# EAGLE design finger-1 (EAGLE 7.2.0)
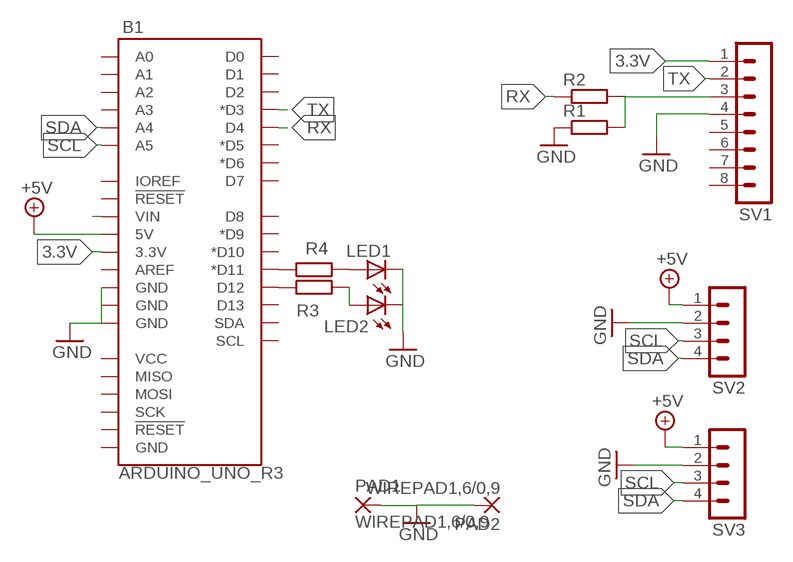
[diagram p0: schematic, sheet 1]

## Parts
B1  ARDUINO_UNO_R3  [ARDUINO_R3]
LED1  LED3MM  [LED3MM]
LED2  LED3MM  [LED3MM]
PAD1  WIREPAD1,6/0,9  [1,6/0,9]
PAD2  WIREPAD1,6/0,9  [1,6/0,9]
R1  R-EU_0207/7  [0207/7]
R2  R-EU_0207/7  [0207/7]
R3  R-EU_0207/7  [0207/7]
R4  R-EU_0207/7  [0207/7]
SV1  MA08-1  [MA08-1]
SV2  MA04-1  [MA04-1]
SV3  MA04-1  [MA04-1]

## Nets
3.3V: B1.3.3V SV1.1
+5V: B1.5V SV2.1 SV3.1
GND: B1.GND@2(GND) B1.GND@3(GND) B1.GND@4(GND) LED1.K(C) LED2.K(C) PAD1.1(P) PAD2.1(P) R1.1 SV1.4 SV2.2 SV3.2
N$1: B1.D12 R3.1
N$2: B1.D11(*D11) R4.1
N$3: LED2.A R3.2
N$4: LED1.A R4.2
N$5: R1.2 R2.2 SV1.3
N$9: B1.VIN
RX: B1.D4 R2.1
SCL: B1.A5 SV2.3 SV3.3
SDA: B1.A4 SV2.4 SV3.4
TX: B1.D3(*D3) SV1.2
Unconnected: B1.A0 B1.A1 B1.A2 B1.A3 B1.AREF B1.D0 B1.D1 B1.D2 B1.D5(*D5) B1.D6(*D6) B1.D7 B1.D8 B1.D9(*D9) B1.D10(*D10) B1.D13 B1.GND@1(GND) B1.IOREF B1.MISO B1.MOSI B1.RESET@1(!RESET!) B1.RESET@2(!RESET!) B1.SCK B1.SCL B1.SDA B1.VCC SV1.5 SV1.6 SV1.7 SV1.8

## Library data of the parts
B1 = treser_lib:ARDUINO_UNO_R3: Arduino Uno R3 Arduino Uno R3 Compatible Footprint with SPI header. Matches PCB size of the original board.
LED1 LED2 = led:LED: LED OSRAM: - CHIPLED LG R971, LG N971, LY N971, LG Q971, LY Q971, LO R971, LY R971 LH N974, LH R974 LS Q976, LO Q976, LY Q976 LO Q996 - Hyper CHIPLED LW Q18S LB Q993, LB Q99A, LB R99A - SideLED LS A670, LO A670, LY A670, LG A670, LP A670 LB A673, LV A673, LT A673, LW A673 LH A674 LY A675 LS A676, LA A676, LO A676, LY A676, LW A676 LS A679, LY A679, LG A679 - Hyper Micro SIDELED® LS Y876, LA Y876, LO Y876, LY Y876 LT Y87S - SmartLED LW L88C, LW L88S LB L89C, LB L89S, LG L890 LS L89K, LO L89K, LY L89K LS L896, LA L896, LO L896, LY L896 - TOPLED LS T670, LO T670, LY T670, LG T670, LP T670 LSG T670, LSP T670, LSY T670, LOP T670, LYG T670 LG T671, LOG T671, LSG T671 LB T673, LV T673, LT T673, LW T673 LH T674 LS T676, LA T676, LO T676, LY T676, LB T676, LH T676, LSB T676, LW T676 LB T67C, LV T67C, LT T67C, LS T67K, LO T67K, LY T67K, LW E67C LS E67B, LA E67B, LO E67B, LY E67B, LB E67C, LV E67C, LT E67C LW T67C LS T679, LY T679, LG T679 LS T770, LO T770, LY T770, LG T770, LP T770 LB T773, LV T773, LT T773, LW T773 LH T774 LS E675, LA E675, LY E675, LS T675 LS T776, LA T776, LO T776, LY T776, LB T776 LHGB T686 LT T68C, LB T68C - Hyper Mini TOPLED® LB M676 - Mini TOPLED Santana® LG M470 LS M47K, LO M47K, LY M47K Source: http://www.osram.convergy.de LUXEON: - LUMILED® LXK2-PW12-R00, LXK2-PW12-S00, LXK2-PW14-U00, LXK2-PW14-V00 LXK2-PM12-R00, LXK2-PM12-S00, LXK2-PM14-U00 LXK2-PE12-Q00, LXK2-PE12-R00, LXK2-PE12-S00, LXK2-PE14-T00, LXK2-PE14-U00 LXK2-PB12-K00, LXK2-PB12-L00, LXK2-PB12-M00, LXK2-PB14-N00, LXK2-PB14-P00, LXK2-PB14-Q00 LXK2-PR12-L00, LXK2-PR12-M00, LXK2-PR14-Q00, LXK2-PR14-R00 LXK2-PD12-Q00, LXK2-PD12-R00, LXK2-PD12-S00 LXK2-PH12-R00, LXK2-PH12-S00 LXK2-PL12-P00, LXK2-PL12-Q00, LXK2-PL12-R00 Source: www.luxeon.com KINGBRIGHT: KA-3528ASYC Source: www.kingbright.com
PAD1 PAD2 = wirepad:WIREPAD: Wire PAD connect wire on PCB
R1-R4 = rcl:R-EU_: RESISTOR, European symbol
SV1 = con-lstb:MA08-1: PIN HEADER; OC_FARNELL: unknown; OC_NEWARK: unknown
SV2 SV3 = con-lstb:MA04-1: PIN HEADER; OC_FARNELL: unknown; OC_NEWARK: unknown

## Board
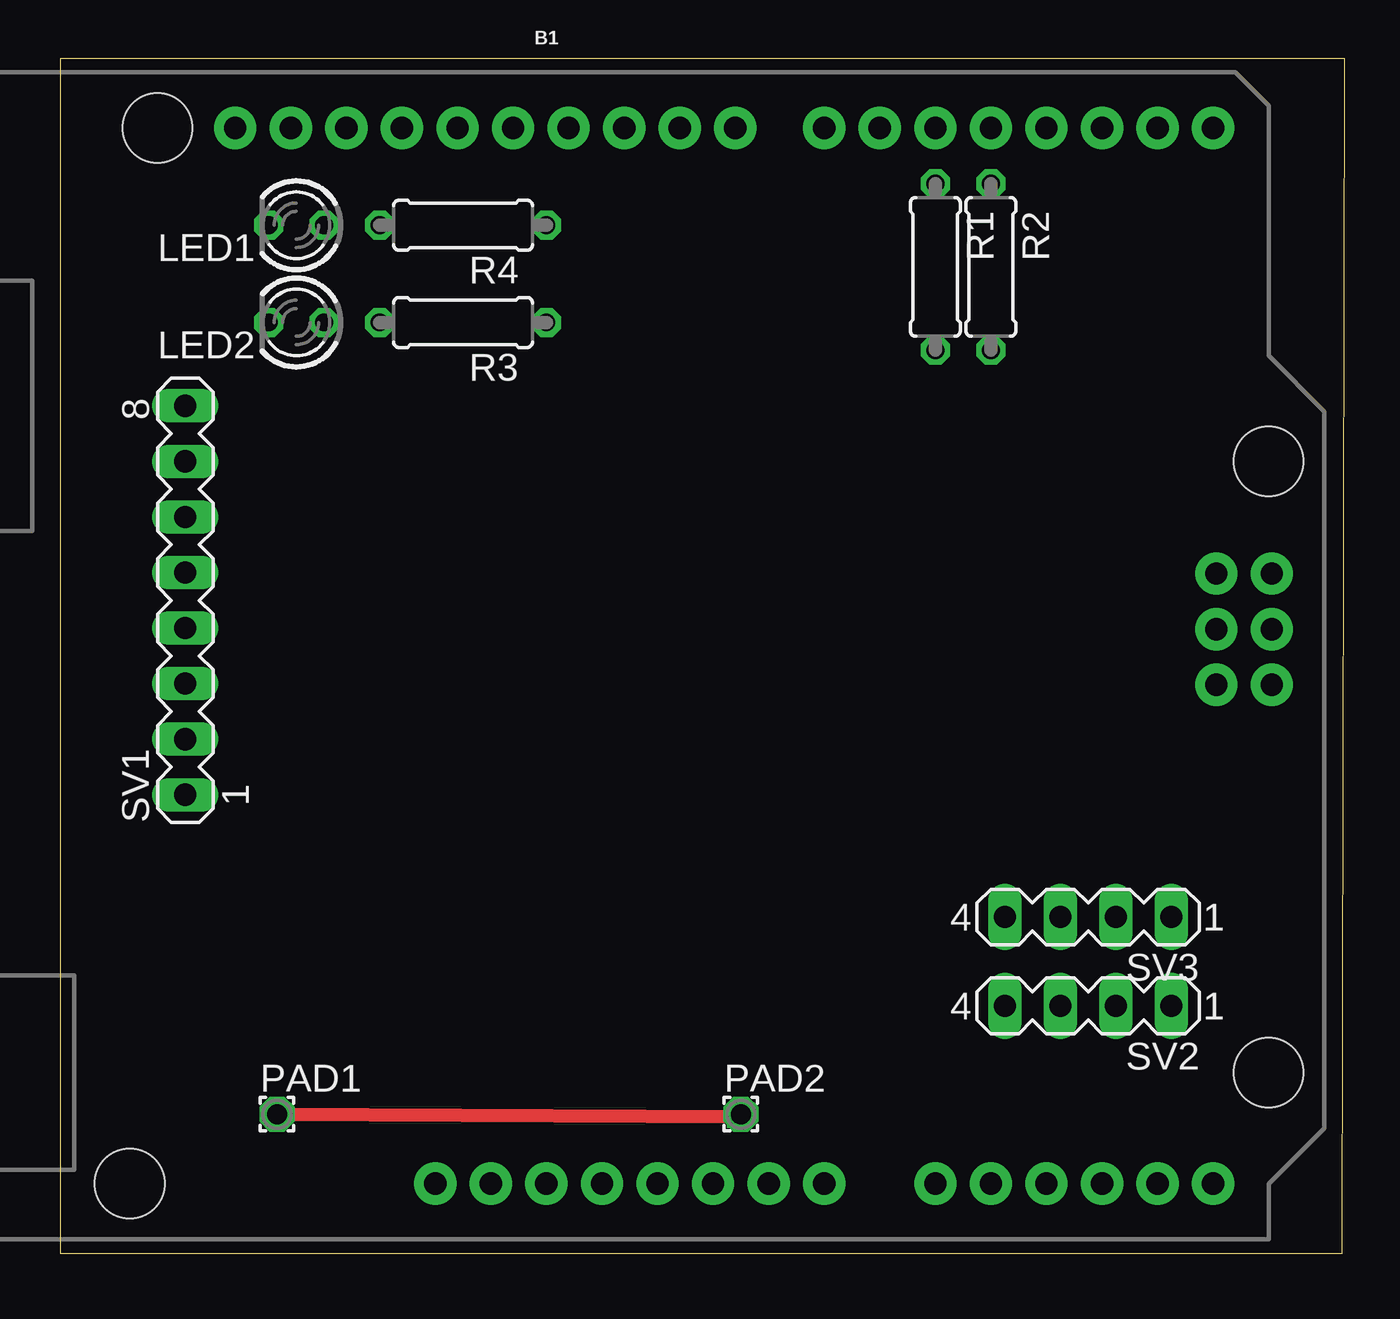
[diagram p1: board, top side]
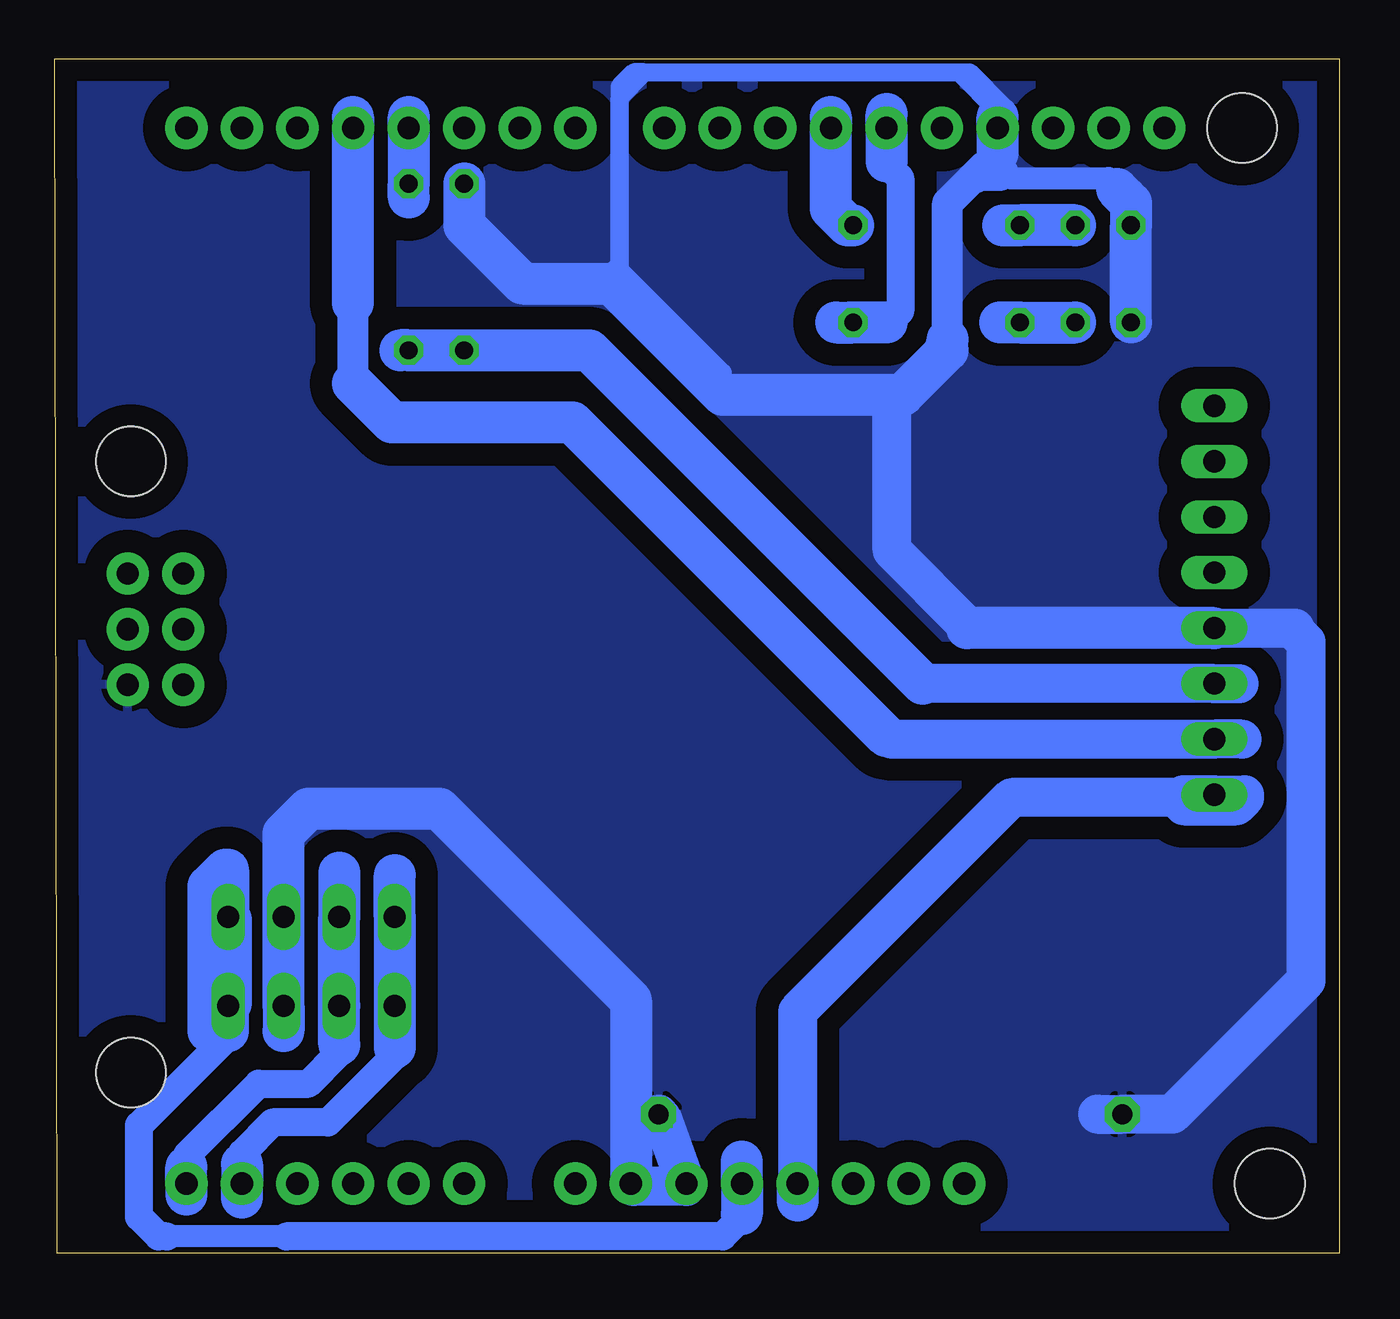
[diagram p2: board, bottom side, seen from below]

Size 58.73 x 54.6 mm. Coordinates in mm from the lower left corner, seen from the top.
Outline: 0,0 58.6,0 58.73,54.6 0,54.6 0,0
Copper layers (1*16): Top 0.035mm / dielectric 1.5mm / Bottom 0.035mm
Design rules "default": minimum track width 10mil, minimum drill 24mil, track to track 8mil, track to pad 8mil, pad to pad 8mil, via to via 8mil, smd to smd 8mil, copper to edge 40mil, drill to drill 8mil, minimum pad ring 10mil, minimum via ring 8mil, stop-mask expansion 4mil, vias tented up to drill 0mil, thermal gap 10mil

### Footprints (pad centres in the part's own frame; a part is rotated, then mirrored left to right if it is on the bottom)
ARDUINO_R3 = drill 1.016 pad 1.93: 3.3V 2.54,-24.13; 5V 5.08,-24.13; A0 17.78,-24.13; A1 20.32,-24.13; A2 22.86,-24.13; A3 25.4,-24.13; A4 27.94,-24.13; A5 30.48,-24.13; AREF -9.144,24.13; D0 30.48,24.13; D1 27.94,24.13; D2 25.4,24.13; D3 22.86,24.13; D4 20.32,24.13; D5 17.78,24.13; D6 15.24,24.13; D7 12.7,24.13; D8 8.636,24.13; D9 6.096,24.13; D10 3.556,24.13; D11 1.016,24.13; D12 -1.524,24.13; D13 -4.064,24.13; GND@1 7.62,-24.13; GND@2 10.16,-24.13; GND@3 -6.604,24.13; GND@4 33.16,-1.32; IOREF -2.54,-24.13; MISO 30.62,3.76; MOSI 33.16,1.22; NC -5.08,-24.13; RESET@1 0,-24.13; RESET@2 30.62,-1.32; SCK 30.62,1.22; SCL -14.224,24.13; SDA -11.684,24.13; VCC 33.16,3.76; VIN 12.7,-24.13 | hole 3.175: -17.78,24.13; 33.02,8.89; 33.02,-19.05; -19.05,-24.13
LED3MM = drill 0.813 octagon: A -1.27,0; K 1.27,0
1,6/0,9 = drill 0.914 pad 1.6 octagon: 1 0,0
0207/7 = drill 0.813 octagon: 1 -3.81,0; 2 3.81,0
MA08-1 = drill 1.016 long: 1 -8.89,0; 2 -6.35,0; 3 -3.81,0; 4 -1.27,0; 5 1.27,0; 6 3.81,0; 7 6.35,0; 8 8.89,0
MA04-1 = drill 1.016 long: 1 -3.81,0; 2 -1.27,0; 3 1.27,0; 4 3.81,0

### Placement (x,y rotation side)
B1  22.23,27.3 0 top
LED1  10.79,46.99 180 top
LED2  10.79,42.55 180 top
PAD1  9.91,6.35 0 top
PAD2  31.11,6.35 0 top
R1  40.01,45.09 270 top
R2  42.55,45.09 270 top
R3  18.41,42.55 180 top
R4  18.41,46.99 180 top
SV1  5.71,29.84 90 top
SV2  46.99,11.3 180 top
SV3  46.99,15.37 180 top

### Tracks (layer width: path | path; a pad name or v marks a point on that pad's centre or on a via)
3.3V
  Bottom 1.778: 4.32,20.95 SV1.1 7.11,20.95 7.11,20.45 4.7,20.45 4.32,20.83 14.99,20.83 24.77,11.05 B1.3.3V
  Bottom 1.93: B1.3.3V 24.77,2.41
+5V
  Bottom 1.016: 48.13,0.76 53.59,0.76
  Bottom 1.27: 27.3,1.78 27.3,1.65 28.19,0.76 48.13,0.76 | 53.59,0.76 53.98,0.76 54.86,1.65 54.86,5.84 50.8,9.91 50.8,10.16
  Bottom 1.93: 27.3,4.19 B1.5V 27.3,1.78 | SV2.1 50.8,10.16 51.69,10.16 51.69,16.76 50.93,17.53 50.93,15.49 50.67,15.24 50.67,11.43 SV2.1 | SV2.1 SV3.1 50.8,17.53
GND  (via drill 0.6)
  Top 0.61: v30.99,6.22 PAD1.1
  Bottom 0.813: 28.19,39.24 28.19,40.26 33.02,45.09 32.89,45.21 32.89,52.83 31.75,53.98 | 31.75,53.98 17.4,53.98 | 17.4,53.98 16.89,53.98 15.37,52.45 15.37,51.69 B1.GND@3 15.62,52.2 17.4,53.98 | 31.75,53.98 32.26,53.98 32.89,53.34 32.89,44.7 33.15,44.45 32.89,44.45 27.69,39.24 26.54,39.24 26.42,39.37
  Bottom 1.016: 15.62,50.29 15.62,49.66 15.37,49.4 15.11,49.15 10.54,49.15 9.78,48.39 9.78,48.26
  Bottom 1.422: 17.91,41.78 17.91,48.01 16.26,49.66 16.26,49.53 16.51,49.28 | 16.64,49.15 16.51,49.28 | 16.51,49.28 15.49,49.28 15.37,49.4
  Bottom 1.778: 17.02,28.57 17.02,28.7 20.45,32.13 20.45,39.24 | SV1.4 2.03,28.57 2.03,28.45 1.52,27.94 1.52,12.45 7.62,6.35 PAD1.1 11.05,6.35 | PAD2.1 v30.99,6.22 29.84,3.05 32.26,3.05 B1.GND@2
  Bottom 1.93: 15.62,51.94 B1.GND@3 15.62,50.29 | 10.16,48.64 9.78,48.26 9.53,48.01 LED1.K LED2.K | SV1.4 17.02,28.57 | R1.1 40.01,46.99 37.34,44.32 33.27,44.32 28.19,39.24 27.69,39.24 20.45,39.24 19.94,39.24 17.91,41.27 17.91,41.78 | 48.26,10.16 SV2.2 SV3.2 48.26,19.18 47.12,20.32 41.15,20.32 32.38,11.56 B1.GND@2
  pour Bottom (isolate 1.016): 0,0 58.42,0 59.05,0 59.05,54.61 0,54.61
N$1
  Bottom 1.27: 20.7,49.91 20.7,49.78 20.07,49.15 20.07,43.05 20.57,42.55 20.7,42.55
  Bottom 1.93: 20.7,52.07 B1.D12 20.7,49.91 | 20.7,42.55 R3.1 22.35,42.55 22.99,42.55
N$2
  Bottom 1.93: R4.1 22.48,46.99 23.24,47.75 B1.D11 23.24,51.94
N$3
  Bottom 1.93: 15.49,42.55 R3.2 LED2.A
N$4
  Bottom 1.93: LED1.A R4.2 15.37,46.99
N$5
  Bottom 1.778: 4.57,26.04 SV1.3 19.05,26.04
  Bottom 1.93: 42.93,41.27 R2.2 R1.2 34.29,41.27 19.05,26.04
RX
  Bottom 1.93: 42.55,51.94 B1.D4 R2.1 42.55,48.26
SCL
  Bottom 1.27: 52.7,3.94 52.7,4.45 49.4,7.75 47.12,7.75 45.72,9.14 45.72,9.53
  Bottom 1.93: 52.7,2.67 B1.A5 52.7,3.94 | 45.72,9.53 SV2.3 SV3.3 45.72,17.4
SDA
  Bottom 1.27: 43.18,9.4 43.18,9.02 46.23,5.97 48.77,5.97 50.16,4.57 50.16,4.06
  Bottom 1.93: 43.18,17.27 SV3.4 SV2.4 43.18,9.4 | 50.16,4.06 B1.A4 50.16,2.54
TX
  Bottom 1.422: 45.09,39.75 45.09,43.43
  Bottom 1.778: 20.7,23.62 20.57,23.62 20.45,23.5 SV1.2 4.45,23.5
  Bottom 1.93: 20.7,23.62 35.05,37.97 43.31,37.97 45.09,39.75 | 45.09,43.43 B1.D3 45.09,51.94